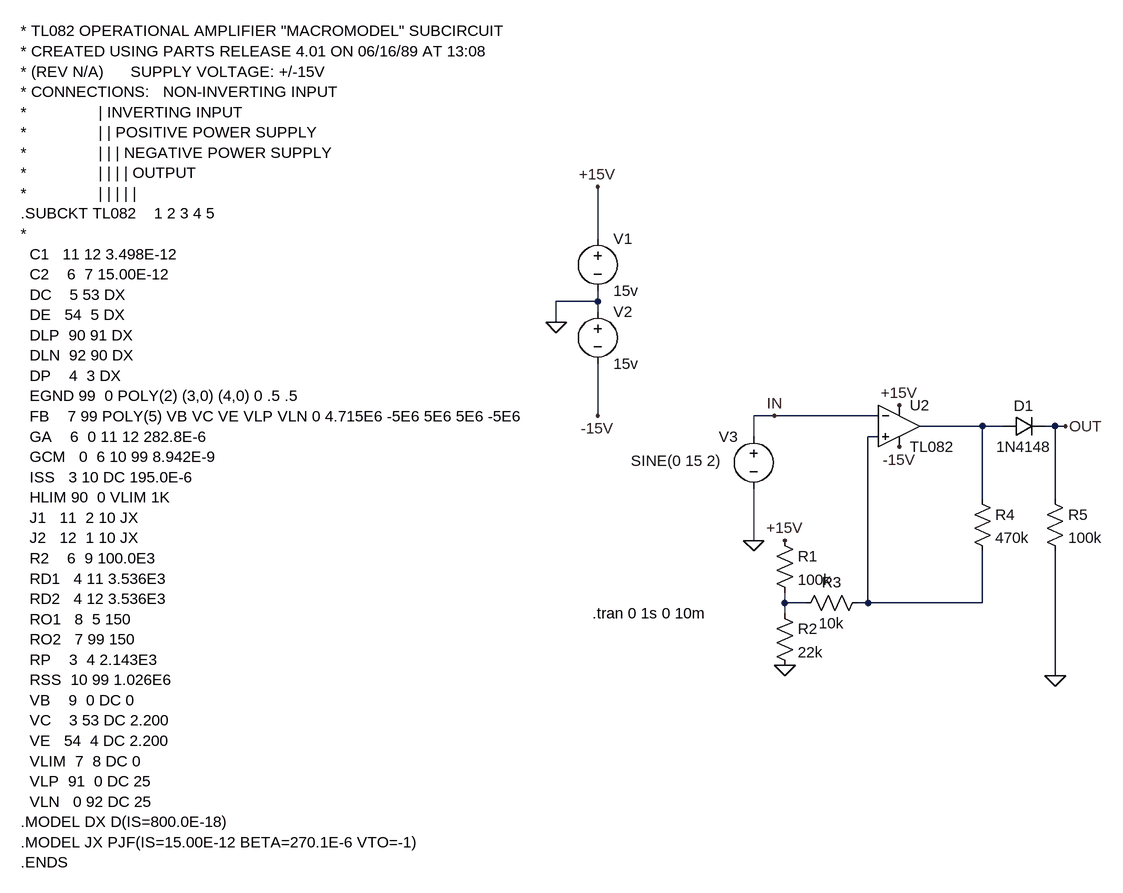
[diagram p0: schematic input_stage.asc]
input_stage.asc, the LTspice schematic file:
Version 4
SHEET 1 2688 2848
WIRE -784 64 -784 -16
WIRE -784 160 -784 144
WIRE -784 160 -848 160
WIRE -784 176 -784 160
WIRE -848 192 -848 160
WIRE -784 336 -784 256
WIRE -512 336 -544 336
WIRE -352 336 -512 336
WIRE -192 352 -288 352
WIRE -160 352 -192 352
WIRE -80 352 -96 352
WIRE -64 352 -80 352
WIRE -544 368 -544 336
WIRE -352 368 -368 368
WIRE -192 464 -192 352
WIRE -80 464 -80 352
WIRE -544 528 -544 448
WIRE -496 624 -496 608
WIRE -464 624 -496 624
WIRE -368 624 -368 368
WIRE -368 624 -384 624
WIRE -192 624 -192 544
WIRE -192 624 -368 624
WIRE -496 640 -496 624
WIRE -80 736 -80 544
FLAG -848 192 0
FLAG -784 -16 +15V
FLAG -784 336 -15V
FLAG -544 528 0
FLAG -512 336 IN
FLAG -320 320 +15V
FLAG -320 384 -15V
FLAG -496 720 0
FLAG -496 528 +15V
FLAG -64 352 OUT
FLAG -80 736 0
SYMBOL voltage -784 48 R0
SYMATTR InstName V1
SYMATTR Value 15v
SYMBOL voltage -784 160 R0
SYMATTR InstName V2
SYMATTR Value 15v
SYMBOL voltage -544 352 M0
WINDOW 123 0 0 Left 0
WINDOW 39 0 0 Left 0
WINDOW 3 49 53 Left 2
SYMATTR Value SINE(0 15 2)
SYMATTR InstName V3
SYMBOL Opamps\\opamp2 -320 288 R0
SYMATTR InstName U2
SYMATTR Value TL082
SYMBOL res -512 512 R0
SYMATTR InstName R1
SYMATTR Value 100k
SYMBOL res -512 624 R0
SYMATTR InstName R2
SYMATTR Value 22k
SYMBOL res -368 608 R90
WINDOW 0 0 56 VBottom 2
WINDOW 3 32 56 VTop 2
SYMATTR InstName R3
SYMATTR Value 10k
SYMBOL res -208 448 R0
SYMATTR InstName R4
SYMATTR Value 470k
SYMBOL diode -160 368 R270
WINDOW 0 32 32 VTop 2
WINDOW 3 0 32 VBottom 2
SYMATTR InstName D1
SYMATTR Value 1N4148
SYMBOL res -96 448 R0
SYMATTR InstName R5
SYMATTR Value 100k
TEXT -1672 -256 Left 2 !* TL082 OPERATIONAL AMPLIFIER "MACROMODEL" SUBCIRCUIT\n* CREATED USING PARTS RELEASE 4.01 ON 06/16/89 AT 13:08\n* (REV N/A)      SUPPLY VOLTAGE: +/-15V\n* CONNECTIONS:   NON-INVERTING INPUT\n*                | INVERTING INPUT\n*                | | POSITIVE POWER SUPPLY\n*                | | | NEGATIVE POWER SUPPLY\n*                | | | | OUTPUT\n*                | | | | |\n.SUBCKT TL082    1 2 3 4 5\n*\n  C1   11 12 3.498E-12\n  C2    6  7 15.00E-12\n  DC    5 53 DX\n  DE   54  5 DX\n  DLP  90 91 DX\n  DLN  92 90 DX\n  DP    4  3 DX\n  EGND 99  0 POLY(2) (3,0) (4,0) 0 .5 .5\n  FB    7 99 POLY(5) VB VC VE VLP VLN 0 4.715E6 -5E6 5E6 5E6 -5E6\n  GA    6  0 11 12 282.8E-6\n  GCM   0  6 10 99 8.942E-9\n  ISS   3 10 DC 195.0E-6\n  HLIM 90  0 VLIM 1K\n  J1   11  2 10 JX\n  J2   12  1 10 JX\n  R2    6  9 100.0E3\n  RD1   4 11 3.536E3\n  RD2   4 12 3.536E3\n  RO1   8  5 150\n  RO2   7 99 150\n  RP    3  4 2.143E3\n  RSS  10 99 1.026E6\n  VB    9  0 DC 0\n  VC    3 53 DC 2.200\n  VE   54  4 DC 2.200\n  VLIM  7  8 DC 0\n  VLP  91  0 DC 25\n  VLN   0 92 DC 25\n.MODEL DX D(IS=800.0E-18)\n.MODEL JX PJF(IS=15.00E-12 BETA=270.1E-6 VTO=-1)\n.ENDS
TEXT -792 640 Left 2 !.tran 0 1s 0 10m

The netlist it stands for:
* input_stage.asc
V1 +15V 0 15v
V2 0 -15V 15v
V3 IN 0 SINE(0 15 2)
XU2 N002 IN +15V -15V N001 TL082  ; pins In+ In- V+ V- OUT
R1 +15V N003 100k
R2 N003 0 22k
R3 N002 N003 10k
R4 N001 N002 470k
D1 N001 OUT 1N4148
R5 OUT 0 100k
.model D D
.lib standard.dio
* TL082 OPERATIONAL AMPLIFIER "MACROMODEL" SUBCIRCUIT
* CREATED USING PARTS RELEASE 4.01 ON 06/16/89 AT 13:08
* (REV N/A)      SUPPLY VOLTAGE: +/-15V
* CONNECTIONS:   NON-INVERTING INPUT
*                | INVERTING INPUT
*                | | POSITIVE POWER SUPPLY
*                | | | NEGATIVE POWER SUPPLY
*                | | | | OUTPUT
*                | | | | |
.SUBCKT TL082    1 2 3 4 5
*
  C1   11 12 3.498E-12
  C2    6  7 15.00E-12
  DC    5 53 DX
  DE   54  5 DX
  DLP  90 91 DX
  DLN  92 90 DX
  DP    4  3 DX
  EGND 99  0 POLY(2) (3,0) (4,0) 0 .5 .5
  FB    7 99 POLY(5) VB VC VE VLP VLN 0 4.715E6 -5E6 5E6 5E6 -5E6
  GA    6  0 11 12 282.8E-6
  GCM   0  6 10 99 8.942E-9
  ISS   3 10 DC 195.0E-6
  HLIM 90  0 VLIM 1K
  J1   11  2 10 JX
  J2   12  1 10 JX
  R2    6  9 100.0E3
  RD1   4 11 3.536E3
  RD2   4 12 3.536E3
  RO1   8  5 150
  RO2   7 99 150
  RP    3  4 2.143E3
  RSS  10 99 1.026E6
  VB    9  0 DC 0
  VC    3 53 DC 2.200
  VE   54  4 DC 2.200
  VLIM  7  8 DC 0
  VLP  91  0 DC 25
  VLN   0 92 DC 25
.MODEL DX D(IS=800.0E-18)
.MODEL JX PJF(IS=15.00E-12 BETA=270.1E-6 VTO=-1)
.ENDS
.tran 0 1s 0 10m
.backanno
.end